# EAGLE design raspberry_aux_board_recover (EAGLE 9.3.2)
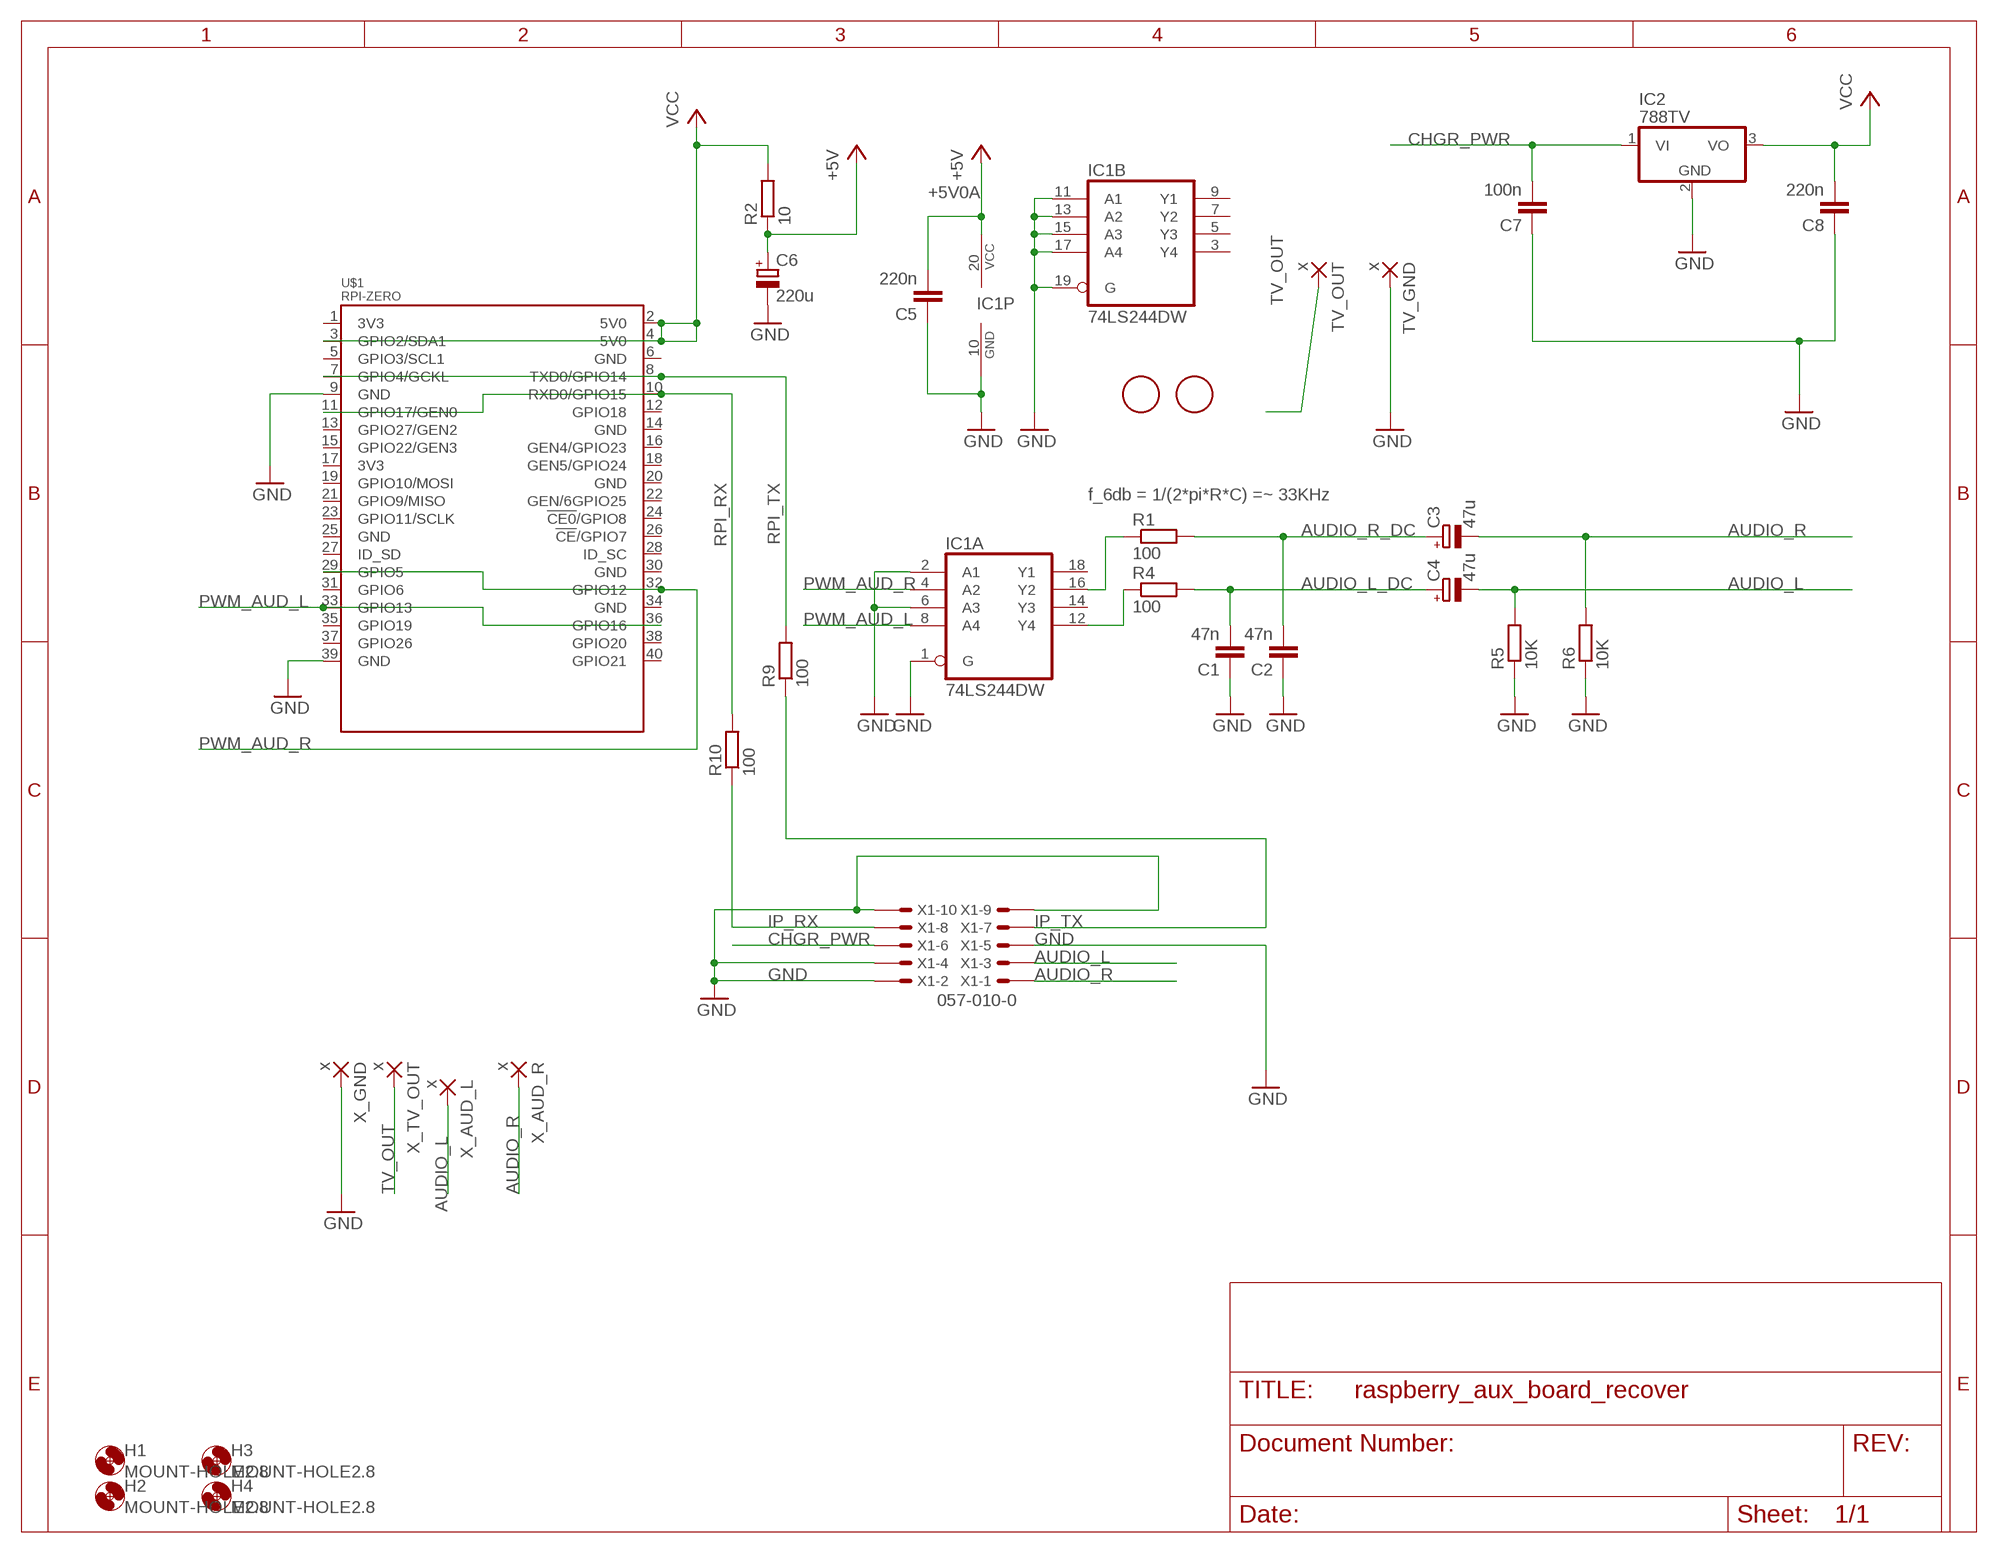
[diagram p0: schematic, sheet 1]

## Parts
C1  47n  C-EU050-025X075  [C050-025X075]
C2  47n  C-EU050-025X075  [C050-025X075]
C3  47u  CPOL-EUE2.5-5  [E2,5-5]
C4  47u  CPOL-EUE2.5-5  [E2,5-5]
C5  220n  C-EU050-050X075  [C050-050X075]
C6  220u  CPOL-EUE5-10.5  [E5-10,5]
C7  100n  C-EU050-050X075  [C050-050X075]
C8  220n  C-EU050-050X075  [C050-050X075]
H1  MOUNT-HOLE2.8  [2,8]
H2  MOUNT-HOLE2.8  [2,8]
H3  MOUNT-HOLE2.8  [2,8]
H4  MOUNT-HOLE2.8  [2,8]
IC1  74LS244DW  [SO20W]
IC2  788TV  [TO220V]
R1  100  R-EU_0207/10  [0207/10]
R2  10  R-EU_0204/7  [0204/7]
R4  100  R-EU_0204/7  [0204/7]
R5  10K  R-EU_0204/5  [0204/5]
R6  10K  R-EU_0204/5  [0204/5]
R9  100  R-EU_0204/7  [0204/7]
R10  100  R-EU_0207/10  [0207/10]
TV_GND  x  2,15/1,0  [2,15/1,0]
TV_OUT  x  2,15/1,0  [2,15/1,0]
U$1  RPI-ZERO  [RASPBERRYPI_BASTELSTUBE_V13_RASPI_BOARD_B+_FULL]
U$2  FIDUCIAL  [FIDUCIAL_1MM]
U$3  FIDUCIAL  [FIDUCIAL_1MM]
X1  057-010-0  [057-010-0]
X_AUD_L  x  2,15/1,0  [2,15/1,0]
X_AUD_R  x  2,15/1,0  [2,15/1,0]
X_GND  x  2,15/1,0  [2,15/1,0]
X_TV_OUT  x  2,15/1,0  [2,15/1,0]

## Nets
+5V0A [power]: C5.2 C6.+ IC1.20(P:VCC) R2.1 ; supply symbol labelled +5V
AUDIO_L [analog_signal]: C4.- R5.2 X1.3 X_AUD_L.1(P)
AUDIO_L_DC: C1.2 C4.+ R4.2
AUDIO_R [analog_signal]: C3.- R6.2 X1.1 X_AUD_R.1(P)
AUDIO_R_DC: C2.2 C3.+ R1.2
CHGR_PWR [power]: C7.2 IC2.1(VI) X1.6
GND [power]: C1.1 C2.1 C5.1 C6.- C7.1 C8.1 IC1.1(A:G) IC1.2(A:A1) IC1.6(A:A3) IC1.10(P:GND) IC1.11(B:A1) IC1.13(B:A2) IC1.15(B:A3) IC1.17(B:A4) IC1.19(B:G) IC2.2(GND) R5.1 R6.1 TV_GND.1(P) U$1.9(GND) U$1.39(GND) X1.2 X1.4 X1.5 X1.9 X1.10 X_GND.1(P)
IP_RX: R10.1 X1.8
IP_TX: R9.1 X1.7
N$1: IC1.12(A:Y4) R4.1
N$2: IC1.16(A:Y2) R1.1
PWM_AUD_L: IC1.8(A:A4) U$1.33(GPIO13) U$1.36(GPIO16)
PWM_AUD_R: IC1.4(A:A2) U$1.29(GPIO5) U$1.32(GPIO12)
RPI_RX: R10.2 U$1.10(RXD0/GPIO15) U$1.11(GPIO17/GEN0)
RPI_TX: R9.2 U$1.7(GPIO4/GCKL) U$1.8(TXD0/GPIO14)
TV_OUT: TV_OUT.1(P) X_TV_OUT.1(P)
VCC [power]: C8.2 IC2.3(VO) R2.2 U$1.2(5V0) U$1.3(GPIO2/SDA1) U$1.4(5V0)
Unconnected: IC1.3(B:Y4) IC1.5(B:Y3) IC1.7(B:Y2) IC1.9(B:Y1) IC1.14(A:Y3) IC1.18(A:Y1) U$1.1(3V3) U$1.5(GPIO3/SCL1) U$1.6(GND) U$1.12(GPIO18) U$1.13(GPIO27/GEN2) U$1.14(GND) U$1.15(GPIO22/GEN3) U$1.16(GEN4/GPIO23) U$1.17(3V3) U$1.18(GEN5/GPIO24) U$1.19(GPIO10/MOSI) U$1.20(GND) U$1.21(GPIO9/MISO) U$1.22(GEN/6GPIO25) U$1.23(GPIO11/SCLK) U$1.24(!CE0!/GPIO8) U$1.25(GND) U$1.26(!CE!/GPIO7) U$1.27(ID_SD) U$1.28(ID_SC) U$1.30(GND) U$1.31(GPIO6) U$1.34(GND) U$1.35(GPIO19) U$1.37(GPIO26) U$1.38(GPIO20) U$1.40(GPIO21)

## Notes on the sheet
- f_6db = 1/(2*pi*R*C) =~ 33KHz

## Library data of the parts
C1 C2 C5 C7 C8 = rcl:C-EU: CAPACITOR, European symbol; SPICEPREFIX: C
C3 C4 C6 = rcl:CPOL-EU: POLARIZED CAPACITOR, European symbol; SPICEPREFIX: C
H1-H4 = holes:MOUNT-HOLE: MOUNTING HOLE with drill center marker
IC1 = 74xx-us:74*244: Octal BUFFER and LINE DRIVER, 3-state
IC2 = linear:78*: Positive VOLTAGE REGULATOR Source: http://cache.national.com/ds/LM/LM78L05.pdf http://www.fairchildsemi.com/ds/LM/LM7805.pdf
R1 R2 R4-R6 R9 R10 = rcl:R-EU_: RESISTOR, European symbol; SPICEPREFIX: R
TV_GND TV_OUT X_AUD_L X_AUD_R X_GND X_TV_OUT = wirepad:2,15/1,0: THROUGH-HOLE PAD
U$1 = RPI-Zero:RPI-ZERO
U$2 U$3 = adafruit:FIDUCIAL: For use by pick and place machines to calibrate the vision/machine, 1mm By microbuilder.eu
X1 = con-panduit:057-010-: CONNECTOR 10-pin series 057 contact pc board low profile headers; OC_FARNELL: unknown; OC_NEWARK: unknown

## Net classes
0 digital_signal: width 0.61 mm, clearance 0.305 mm
1 analog_signal: width 0.61 mm, clearance 0.205 mm to class 0, clearance 0.305 mm
2 power: width 0.813 mm, clearance 0.205 mm to class 0, clearance 0.205 mm to class 1, clearance 0.305 mm

## Board
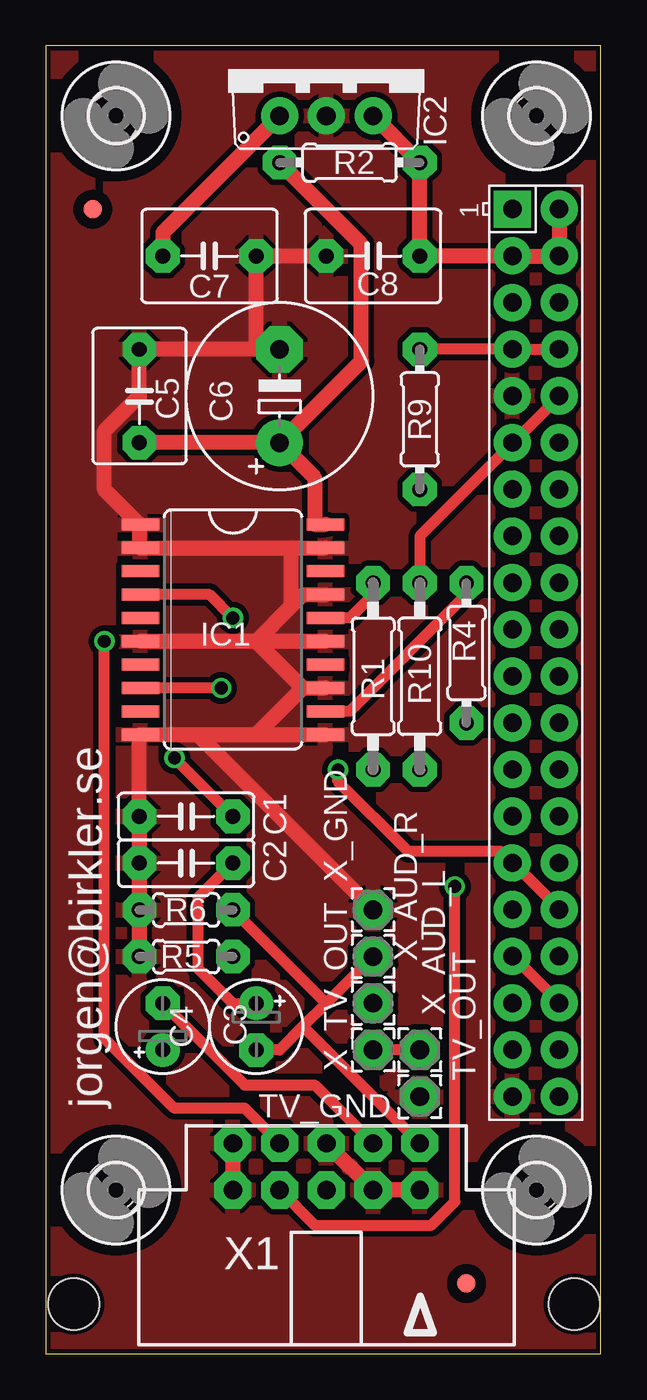
[diagram p1: board, top side]
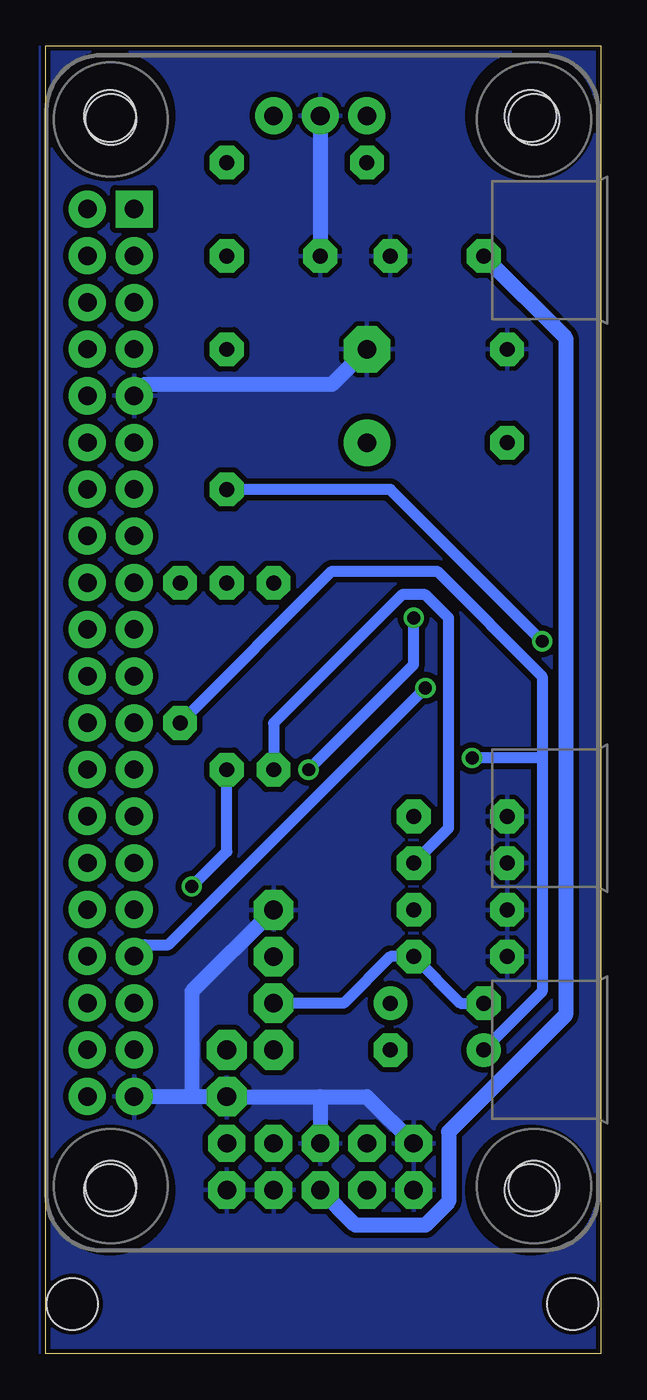
[diagram p2: board, bottom side, seen from below]

Size 30.15 x 71.11 mm. Coordinates in mm from the lower left corner, seen from the top.
Outline: 0,0 30.15,0 30.15,71.11 0,71.11 0,0
Copper layers (1*16): Top 0.035mm / dielectric 1.5mm / Bottom 0.035mm
Design rules "default *": minimum track width 24mil, minimum drill 0.7mm, track to track 6mil, track to pad 6mil, pad to pad 6mil, via to via 6mil, smd to smd 6mil, copper to edge 10mil, drill to drill 6mil, minimum pad ring 20mil, minimum via ring 8mil, stop-mask expansion 4mil, vias tented up to drill 0mil, thermal gap 10mil

### Footprints (pad centres in the part's own frame; a part is rotated, then mirrored left to right if it is on the bottom)
C050-025X075 = drill 0.813 octagon: 1 -2.54,0; 2 2.54,0
E2,5-5 = drill 0.813 pad 1.6: + -1.27,0 | drill 0.813 pad 1.6 octagon: - 1.27,0
C050-050X075 = drill 0.813 octagon: 1 -2.54,0; 2 2.54,0
E5-10,5 = drill 1.016 pad 2.54: + -2.54,0 | drill 1.016 pad 2.54 octagon: - 2.54,0
2,8 = hole 2.8: 0,0
SO20W = smd 0.66 x 2.032: 1 -5.715,-5.029; 2 -4.445,-5.029; 3 -3.175,-5.029; 4 -1.905,-5.029; 5 -0.635,-5.029; 6 0.635,-5.029; 7 1.905,-5.029; 8 3.175,-5.029; 9 4.445,-5.029; 10 5.715,-5.029; 11 5.715,5.029; 12 4.445,5.029; 13 3.175,5.029; 14 1.905,5.029; 15 0.635,5.029; 16 -0.635,5.029; 17 -1.905,5.029; 18 -3.175,5.029; 19 -4.445,5.029; 20 -5.715,5.029
TO220V = drill 1.016 long: 1 -2.54,-2.54; 2 0,-2.54; 3 2.54,-2.54
0207/10 = drill 0.813 octagon: 1 -5.08,0; 2 5.08,0
0204/7 = drill 0.813 octagon: 1 -3.81,0; 2 3.81,0
0204/5 = drill 0.813 octagon: 1 -2.54,0; 2 2.54,0
2,15/1,0 = drill 1.016 pad 2.159 octagon: 1 0,0
RASPBERRYPI_BASTELSTUBE_V13_RASPI_BOARD_B+_FULL = drill 1 pad 1.778 square: 1 8.37,25.23 | drill 1 pad 1.778: 2 8.37,27.77; 3 10.91,25.23; 4 10.91,27.77; 5 13.45,25.23; 6 13.45,27.77; 7 15.99,25.23; 8 15.99,27.77; 9 18.53,25.23; 10 18.53,27.77; 11 21.07,25.23; 12 21.07,27.77; 13 23.61,25.23; 14 23.61,27.77; 15 26.15,25.23; 16 26.15,27.77; 17 28.69,25.23; 18 28.69,27.77; 19 31.23,25.23; 20 31.23,27.77; 21 33.77,25.23; 22 33.77,27.77; 23 36.31,25.23; 24 36.31,27.77; 25 38.85,25.23; 26 38.85,27.77; 27 41.39,25.23; 28 41.39,27.77; 29 43.93,25.23; 30 43.93,27.77; 31 46.47,25.23; 32 46.47,27.77; 33 49.01,25.23; 34 49.01,27.77; 35 51.55,25.23; 36 51.55,27.77; 37 54.09,25.23; 38 54.09,27.77; 39 56.63,25.23; 40 56.63,27.77 | hole 2.75: 3.5,3.5; 3.5,26.5; 61.5,3.5; 61.5,26.5
FIDUCIAL_1MM = smd 1 x 1: 1 0,0
057-010-0 = drill 1 octagon: 1 -5.08,-5.08; 2 -5.08,-2.54; 3 -2.54,-5.08; 4 -2.54,-2.54; 5 0,-5.08; 6 0,-2.54; 7 2.54,-5.08; 8 2.54,-2.54; 9 5.08,-5.08; 10 5.08,-2.54 | hole 2.8: -13.48,3.66; 13.73,3.66

### Placement (x,y rotation side)
C1  7.62,29.21 0 top
C2  7.62,26.67 0 top
C3  11.43,17.78 270 top
C4  6.35,17.78 90 top
C5  5.08,52.07 270 top
C6  12.7,52.07 90 top
C7  8.89,59.69 180 top
C8  17.78,59.69 0 top
H1  3.81,8.89 0 top
H2  26.67,8.89 0 top
H3  26.67,67.31 0 top
H4  3.81,67.31 0 top
IC1  10.16,39.37 270 top
IC2  15.24,69.85 0 top
R1  17.78,36.83 270 top
R2  16.51,64.77 0 top
R4  22.86,38.1 270 top
R5  7.62,21.59 0 top
R6  7.62,24.13 0 top
R9  20.32,50.8 90 top
R10  20.32,36.83 90 top
TV_GND  20.32,13.97 0 top
TV_OUT  20.32,16.51 0 top
U$1  0.13,70.61 270 top
U$2  22.86,3.81 0 top
U$3  2.54,62.23 0 top
X1  15.24,6.35 180 top
X_AUD_L  17.78,19.05 0 top
X_AUD_R  17.78,21.59 0 top
X_GND  17.78,24.13 0 top
X_TV_OUT  17.78,16.51 0 top

### Tracks (layer width: path | path; a pad name or v marks a point on that pad's centre or on a via)
+5V0A
  Top 0.813: C6.+ 14.6,47.62 14.6,45.09 IC1.20 | C6.+ C5.2 | R2.1 17.14,60.33 17.14,53.98 C6.+
AUDIO_L
  Top 0.61: X1.3 14.6,14.61 10.79,14.61 C4.-
  Bottom 0.61: C4.- 7.62,19.05 R5.2 11.43,21.59 13.97,19.05 X_AUD_L.1
AUDIO_L_DC  (via drill 0.7)
  Top 0.61: v6.99,32.38 C1.2
  Bottom 0.61: C4.+ 3.17,19.68 3.17,32.38 | 3.17,32.38 3.17,36.83 8.89,42.55 14.6,42.55 R4.2 | 3.17,32.38 v6.99,32.38
AUDIO_R
  Top 0.61: C3.- 12.7,16.51 13.97,17.78 | X_AUD_R.1 15.24,19.05 | 15.24,19.05 13.97,17.78 | 15.24,19.05 R6.2 | 13.97,17.78 X1.1
AUDIO_R_DC
  Top 0.61: C3.+ 10.16,19.05 8.26,20.95 8.26,24.76 C2.2
  Bottom 0.61: R1.2 17.78,34.29 10.79,41.28 9.53,41.28 8.26,40.01 8.26,28.57 C2.2
CHGR_PWR
  Top 0.813: C7.2 6.35,60.96 IC2.1
  Bottom 0.813: X1.6 13.33,6.98 9.53,6.98 8.26,8.26 8.26,12.07 1.9,18.41 1.9,55.25 C7.2
GND
  Top 0.813: C8.1 C7.1 11.43,54.61 | C6.- 11.43,54.61 | 11.43,54.61 C5.1 5.08,52.07 3.17,50.16 3.17,46.99 5.08,45.09 | X1.2 X1.4 X1.5 | X1.9 X1.10 | 5.08,45.09 5.08,43.82 IC1.2 13.33,43.82 | 13.33,43.82 IC1.19 | IC1.15 11.43,38.73 | 11.43,38.73 IC1.6 | 13.97,36.2 IC1.13 | 11.43,38.73 13.97,36.2 | IC1.17 13.97,41.28 13.33,40.64 | 11.43,38.73 13.33,40.64 | 13.33,40.64 13.33,43.82 | R5.1 R6.1 C2.1 C1.1 5.08,33.66 IC1.10 8.26,33.66 | 8.26,33.66 11.43,33.66 | 11.43,33.66 IC1.11 | 8.26,33.66 X_GND.1 | 11.43,33.66 13.97,36.2 | 5.08,45.09 IC1.1
  Bottom 0.813: C6.- 14.6,52.71 24.77,52.71 U$1.9 | IC2.2 C8.1 | 22.23,13.97 TV_GND.1 15.24,13.97 | 22.23,13.97 24.77,13.97 U$1.39 | X1.9 12.7,13.97 15.24,13.97 | 15.24,13.97 X1.5 | 22.23,13.97 22.23,19.68 X_GND.1
  pour Bottom: 0,71.12 30.48,71.12 30.48,0 0,0
  pour Top: 0,71.12 30.48,71.12 30.48,0 0,0
IP_RX  (via drill 0.7)
  Top 0.61: v22.23,25.4 22.23,8.26 20.95,6.98 14.6,6.98 X1.8
  Bottom 0.61: R10.1 20.32,27.3 v22.23,25.4
IP_TX  (via drill 0.7)
  Top 0.61: v3.17,38.73 3.17,17.14 6.99,13.34 10.79,13.34 X1.7
  Bottom 0.61: R9.1 11.43,46.99 v3.17,38.73
N$1
  Top 0.61: IC1.12 16.51,34.92 22.86,41.28 R4.1
N$2
  Top 0.61: IC1.16 16.51,40.01 17.78,41.28 R1.1
PWM_AUD_L  (via drill 0.7)
  Top 0.61: v9.53,36.2 IC1.8 | U$1.36 27.3,19.68 25.4,21.59 U$1.33
  Bottom 0.61: v9.53,36.2 23.49,22.22 24.77,22.22 U$1.33
PWM_AUD_R  (via drill 0.7)
  Top 0.61: IC1.4 8.89,41.28 v10.16,40.01 | v15.87,31.75 15.87,31.11 19.68,27.3 24.77,27.3 U$1.29 25.4,26.67 27.3,24.76 U$1.32
  Bottom 0.61: v10.16,40.01 10.16,37.47 v15.87,31.75
RPI_RX
  Top 0.61: R10.2 20.32,44.45 25.4,49.53 | 25.4,49.53 27.3,51.44 27.3,52.07 U$1.10 | 25.4,49.53 U$1.11
RPI_TX
  Top 0.61: R9.2 24.77,54.61 U$1.7 25.4,54.61 27.3,54.61 U$1.8
TV_OUT
  Top 0.61: TV_OUT.1 X_TV_OUT.1
VCC
  Top 0.813: IC2.3 R2.2 C8.2 24.77,59.69 U$1.3 25.4,59.69 27.3,59.69 U$1.4 27.94,60.33 27.94,62.23 U$1.2

### Text on the board
tPlace: jorgen@birkler.se